# Altium schematic sheet Power_Management.SchDoc
size A; SheetNumber: 5; SheetTotal: 6
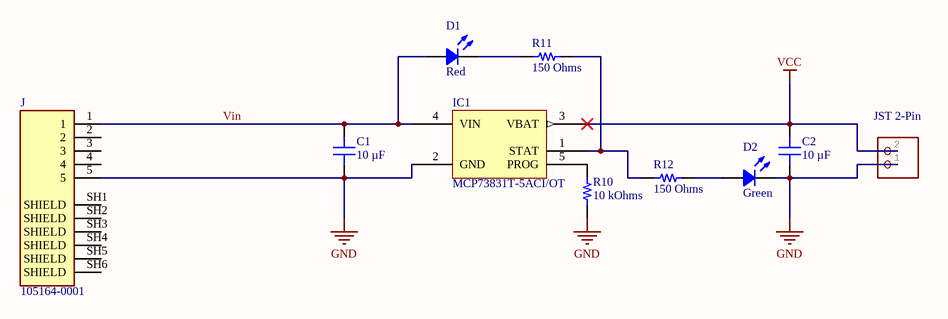
[diagram p0: Power_Management.SchDoc]

## Parts
C1  10 µF  [CAP 0402_1005]
C2  10 µF  [CAP 0402_1005]
CN1  JSTPH  [Lazy-JST]  (value not drawn)
D1  Red  [LED 0402_1005 RED]
D2  Green  [LED 0402_1005 GREEN]
IC1  MCP73831T-5ACI/OT  [MICROCHIP SOT-23-5 OT]
J  105164-0001  [MOLEX_105164-0001]
R10  10 kOhms  [RES 0201_0603]
R11  150 Ohms  [RES 0201_0603]
R12  150 Ohms  [RES 0201_0603]

## Nets
GND: C1.1 C2.1 CN1.1 D2.2 IC1.2(GND) J.5 R10.1
VCC: C2.2 CN1.2 IC1.3(VBAT)
Vin: C1.2 D1.1 IC1.4(VIN) J.1
NetD1_2: D1.2 R11.1
NetD2_1: D2.1 R12.2
NetIC1_1: IC1.1(STAT) R11.2 R12.1
NetIC1_5: IC1.5(PROG) R10.2

Not connected (* = marked no-connect by the designer): J 2 3 4 SH1(SHIELD) SH2(SHIELD) SH3(SHIELD) SH4(SHIELD) SH5(SHIELD) SH6(SHIELD)

## Notes on the sheet
- (near CN1) JST 2-Pin

## Library data of the parts
C1 C2 = CL05A106MQ5NUNC: CAP CER 10UF 6.3V X5R 0402; manufacturer: Samsung Electro-Mechanics; Tolerance: ±20%; Part Number: CL05A106MQ5NUNC; Value: 10 µF; Applications: General Purpose; Capacitance: 10 µF; componentlink1description: Datasheet; componentlink1url: http://www.samsungsem.com/kr/support/product-search/mlcc/CL05A106MQ5NUNC.jsp; componentlink2description: DigiKey Link; componentlink2url: https://www.digikey.com/en/products/detail/samsung-electro-mechanics/CL05A106MQ5NUNC/3887109; Device Package: 0402 (1005 Metric); lastupdated: 7/26/2022 2:28:04 AM; Lifecycle Status: Active; Minimum Order: 1; Mounting Type: Surface Mount, MLCC; Operating Temperature: -55°C ~ 85°C; Package / Case: 0402 (1005 Metric); packaging: TapeAndReel; partid: 1766; Part Status: Active; price: 0.03; series: CL; Size / Dimension: 0.039" L x 0.020" W (1.00mm x 0.50mm); Supplier 1: DigiKey; Supplier Part Number 1: 1276-1451-1-ND; Temperature Coefficient: X5R; Thickness (Max): 0.028" (0.70mm); Voltage - Rated: 6.3V
CN1 = JST_2PIN: JST 2-Pin Right-Angle Connector  PH-Series - 4UConnector: 17311  SH-Series - 4UConnector: 07278; GateName_1: G$1; SymbolName_1: PINHD2; LibraryName: microbuilder; DeviceSetName: JST_2PIN
D1 = APHHS1005SURCK: LED RED CLEAR CHIP SMD; Manufacturer: Kingbright; Configuration: Standard; Current - Test: 20mA; Lens Color: Colorless; Lens Size: 0.80mm x 0.50mm; Lens Style: Rectangle with Flat Top; Millicandela Rating: 70mcd; Viewing Angle: 120°; Voltage - Forward (Vf) (Typ): 1.95V; Wavelength - Dominant: 630nm; Wavelength - Peak: 645nm; Part Number: APHHS1005SURCK; Color: Red; ComponentLink1Description: Datasheet; ComponentLink1URL: http://www.kingbrightusa.com/images/catalog/SPEC/APHHS1005SURCK.pdf; ComponentLink2Description: DigiKey Link; ComponentLink2URL: https://www.digikey.com/en/products/detail/kingbright/APHHS1005SURCK/1747502; Device Package: 0402 (1005 Metric); Height (Max): 0.60mm; LastUpdated: 7/29/2022 2:39:04 PM; Lens Transparency: Clear; Lifecycle Status: Active; Minimum Order: 1; Mounting Type: Surface Mount; Package / Case: 0402 (1005 Metric); Packaging: TapeAndReel; PartId: 520; Part Status: Active; Price: 0.09; Series: -; Size / Dimension: 1.00mm L x 0.50mm W; Supplier 1: DigiKey; Supplier Part Number 1: 754-1104-1-ND; Supplier Device Package: Chip LED; Value: Red
D2 = APHHS1005CGCK: LED GREEN CLEAR CHIP SMD; Manufacturer: Kingbright; Configuration: Standard; Current - Test: 20mA; Lens Color: Colorless; Lens Size: 0.80mm x 0.50mm; Lens Style: Rectangle with Flat Top; Millicandela Rating: 50mcd; Viewing Angle: 120°; Voltage - Forward (Vf) (Typ): 2.1V; Wavelength - Dominant: 570nm; Wavelength - Peak: 574nm; Part Number: APHHS1005CGCK; Color: Green; ComponentLink1Description: Datasheet; ComponentLink1URL: http://www.kingbrightusa.com/images/catalog/SPEC/APHHS1005CGCK.pdf; ComponentLink2Description: DigiKey Link; ComponentLink2URL: https://www.digikey.com/en/products/detail/kingbright/APHHS1005CGCK/1747499; Device Package: 0402 (1005 Metric); Height (Max): 0.60mm; LastUpdated: 7/29/2022 2:38:46 PM; Lens Transparency: Clear; Lifecycle Status: Active; Minimum Order: 1; Mounting Type: Surface Mount; Package / Case: 0402 (1005 Metric); Packaging: TapeAndReel; PartId: 713; Part Status: Active; Price: 0.07; Series: -; Size / Dimension: 1.00mm L x 0.50mm W; Supplier 1: DigiKey; Supplier Part Number 1: 754-1101-1-ND; Supplier Device Package: Chip LED; Value: Green
IC1 = MCP73831T-5ACI/OT: IC CONTRLR LI-ION 4.50V SOT23-5; Part Number: MCP73831T-5ACI/OT
J = 105164-0001: USB - micro B USB 2.0 Receptacle Connector 5 Position Surface Mount, Right Angle; Through Hole; MP: 1051640001; MF: Molex; Price: None; Package: None; Value: *; Availability: Unavailable; SnapEDA_Link: https://www.snapeda.com/parts/1051640001/Molex/view-part/1758198/?ref=snap
R10 = RC0201FR-0710KL: RES 10K OHM 1% 1/20W 0201; Manufacturer: Yageo; Power (Watts): 0.05W, 1/20W; Temperature Coefficient: ±200ppm/°C; Part Number: RC0201FR-0710KL; Value: 10 kOhms; ComponentLink1Description: Datasheet; ComponentLink1URL: https://www.yageo.com/upload/media/product/productsearch/datasheet/rchip/PYu-RC_Group_51_RoHS_L_10.pdf; ComponentLink2Description: DigiKey Link; ComponentLink2URL: https://www.digikey.com/en/products/detail/yageo/RC0201FR-0710KL/1948870; Composition: Thick Film; Device Package: 0201 (0603 Metric); Features: Moisture Resistant; Height - Seated (Max): 0.010" (0.26mm); LastUpdated: 8/4/2022 4:39:11 AM; Lifecycle Status: Active; Minimum Order: 1; Number of Terminations: 2; Operating Temperature: -55°C ~ 125°C; Package / Case: 0201 (0603 Metric); Packaging: CutTape; PartId: 2281; Part Status: Active; Price: 0.01; Resistance: 10 kOhms; Series: RC_L; Size / Dimension: 0.024" L x 0.012" W (0.60mm x 0.30mm); Supplier 1: DigiKey; Supplier Part Number 1: 311-10.0KMCT-ND; Supplier Device Package: 0201; Tolerance: ±1%
R11 R12 = RC0201FR-07150RL: RES 150 OHM 1% 1/20W 0201; Manufacturer: Yageo; Power (Watts): 0.05W, 1/20W; Temperature Coefficient: ±200ppm/°C; Part Number: RC0201FR-07150RL; Value: 150 Ohms; ComponentLink1Description: Datasheet; ComponentLink1URL: https://www.yageo.com/upload/media/product/productsearch/datasheet/rchip/PYu-RC_Group_51_RoHS_L_10.pdf; ComponentLink2Description: DigiKey Link; ComponentLink2URL: https://www.digikey.com/en/products/detail/yageo/RC0201FR-07150RL/3202385; Composition: Thick Film; Device Package: 0201 (0603 Metric); Features: Moisture Resistant; Height - Seated (Max): 0.010" (0.26mm); LastUpdated: 8/4/2022 4:39:17 AM; Lifecycle Status: Active; Minimum Order: 1; Number of Terminations: 2; Operating Temperature: -55°C ~ 125°C; Package / Case: 0201 (0603 Metric); Packaging: CutTape; PartId: 1399; Part Status: Active; Price: 0.01; Resistance: 150 Ohms; Series: RC_L; Size / Dimension: 0.024" L x 0.012" W (0.60mm x 0.30mm); Supplier 1: DigiKey; Supplier Part Number 1: YAG2273CT-ND; Supplier Device Package: 0201; Tolerance: ±1%